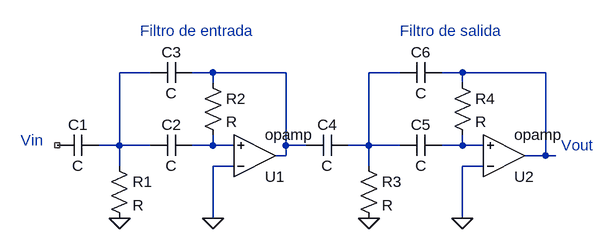
[diagram p0: schematic filter_4th_order_mf_analytic.asc]
filter_4th_order_mf_analytic.asc, the LTspice schematic file:
Version 4
SHEET 1 948 680
WIRE 80 192 32 192
WIRE 176 192 144 192
WIRE 288 192 176 192
WIRE 464 192 416 192
WIRE 560 192 528 192
WIRE 688 192 560 192
WIRE 176 208 176 192
WIRE 560 208 560 192
WIRE 32 304 32 192
WIRE 32 304 0 304
WIRE 80 304 32 304
WIRE 176 304 176 288
WIRE 176 304 144 304
WIRE 208 304 176 304
WIRE 288 304 288 192
WIRE 320 304 288 304
WIRE 416 304 416 192
WIRE 416 304 384 304
WIRE 464 304 416 304
WIRE 560 304 560 288
WIRE 560 304 528 304
WIRE 592 304 560 304
WIRE 288 320 288 304
WIRE 288 320 272 320
WIRE 688 320 688 192
WIRE 688 320 656 320
WIRE 704 320 688 320
WIRE 32 336 32 304
WIRE 208 336 176 336
WIRE 416 336 416 304
WIRE 592 336 560 336
WIRE 176 416 176 336
WIRE 560 416 560 336
FLAG 32 416 0
FLAG 176 416 0
FLAG 416 416 0
FLAG 560 416 0
SYMBOL Opamps/opamp 240 384 M180
SYMATTR InstName U1
SYMBOL cap 0 288 R90
WINDOW 0 0 32 VBottom 2
WINDOW 3 32 32 VTop 2
SYMATTR InstName C1
SYMBOL res 16 320 R0
SYMATTR InstName R1
SYMBOL cap 144 288 R90
WINDOW 0 0 32 VBottom 2
WINDOW 3 32 32 VTop 2
SYMATTR InstName C2
SYMBOL res 160 192 R0
SYMATTR InstName R2
SYMBOL cap 144 176 R90
WINDOW 0 0 32 VBottom 2
WINDOW 3 32 32 VTop 2
SYMATTR InstName C3
SYMBOL Opamps/opamp 624 384 M180
SYMATTR InstName U2
SYMBOL cap 384 288 R90
WINDOW 0 0 32 VBottom 2
WINDOW 3 32 32 VTop 2
SYMATTR InstName C4
SYMBOL res 400 320 R0
SYMATTR InstName R3
SYMBOL cap 528 288 R90
WINDOW 0 0 32 VBottom 2
WINDOW 3 32 32 VTop 2
SYMATTR InstName C5
SYMBOL res 544 192 R0
SYMATTR InstName R4
SYMBOL cap 528 176 R90
WINDOW 0 0 32 VBottom 2
WINDOW 3 32 32 VTop 2
SYMATTR InstName C6
TEXT -120 296 Left 2 ;Vin
TEXT 712 304 Left 2 ;Vout
TEXT 64 128 Left 2 ;Filtro de entrada
TEXT 464 128 Left 2 ;Filtro de salida

The netlist it stands for:
* filter_4th_order_mf_analytic.asc
XU1 0 N005 N002 opamp Aol=100K GBW=10Meg  ; pins invin noninvin out
C1 N001 NC_01 C
R1 N001 0 R
C2 N005 N001 C
R2 N002 N005 R
C3 N002 N001 C
XU2 0 N006 N004 opamp Aol=100K GBW=10Meg  ; pins invin noninvin out
C4 N003 N002 C
R3 N003 0 R
C5 N006 N003 C
R4 N004 N006 R
C6 N004 N003 C
* Vin
* Vout
* Filtro de entrada
* Filtro de salida
.backanno
.end